# EAGLE design logicBlocks-Input (EAGLE 6.2)
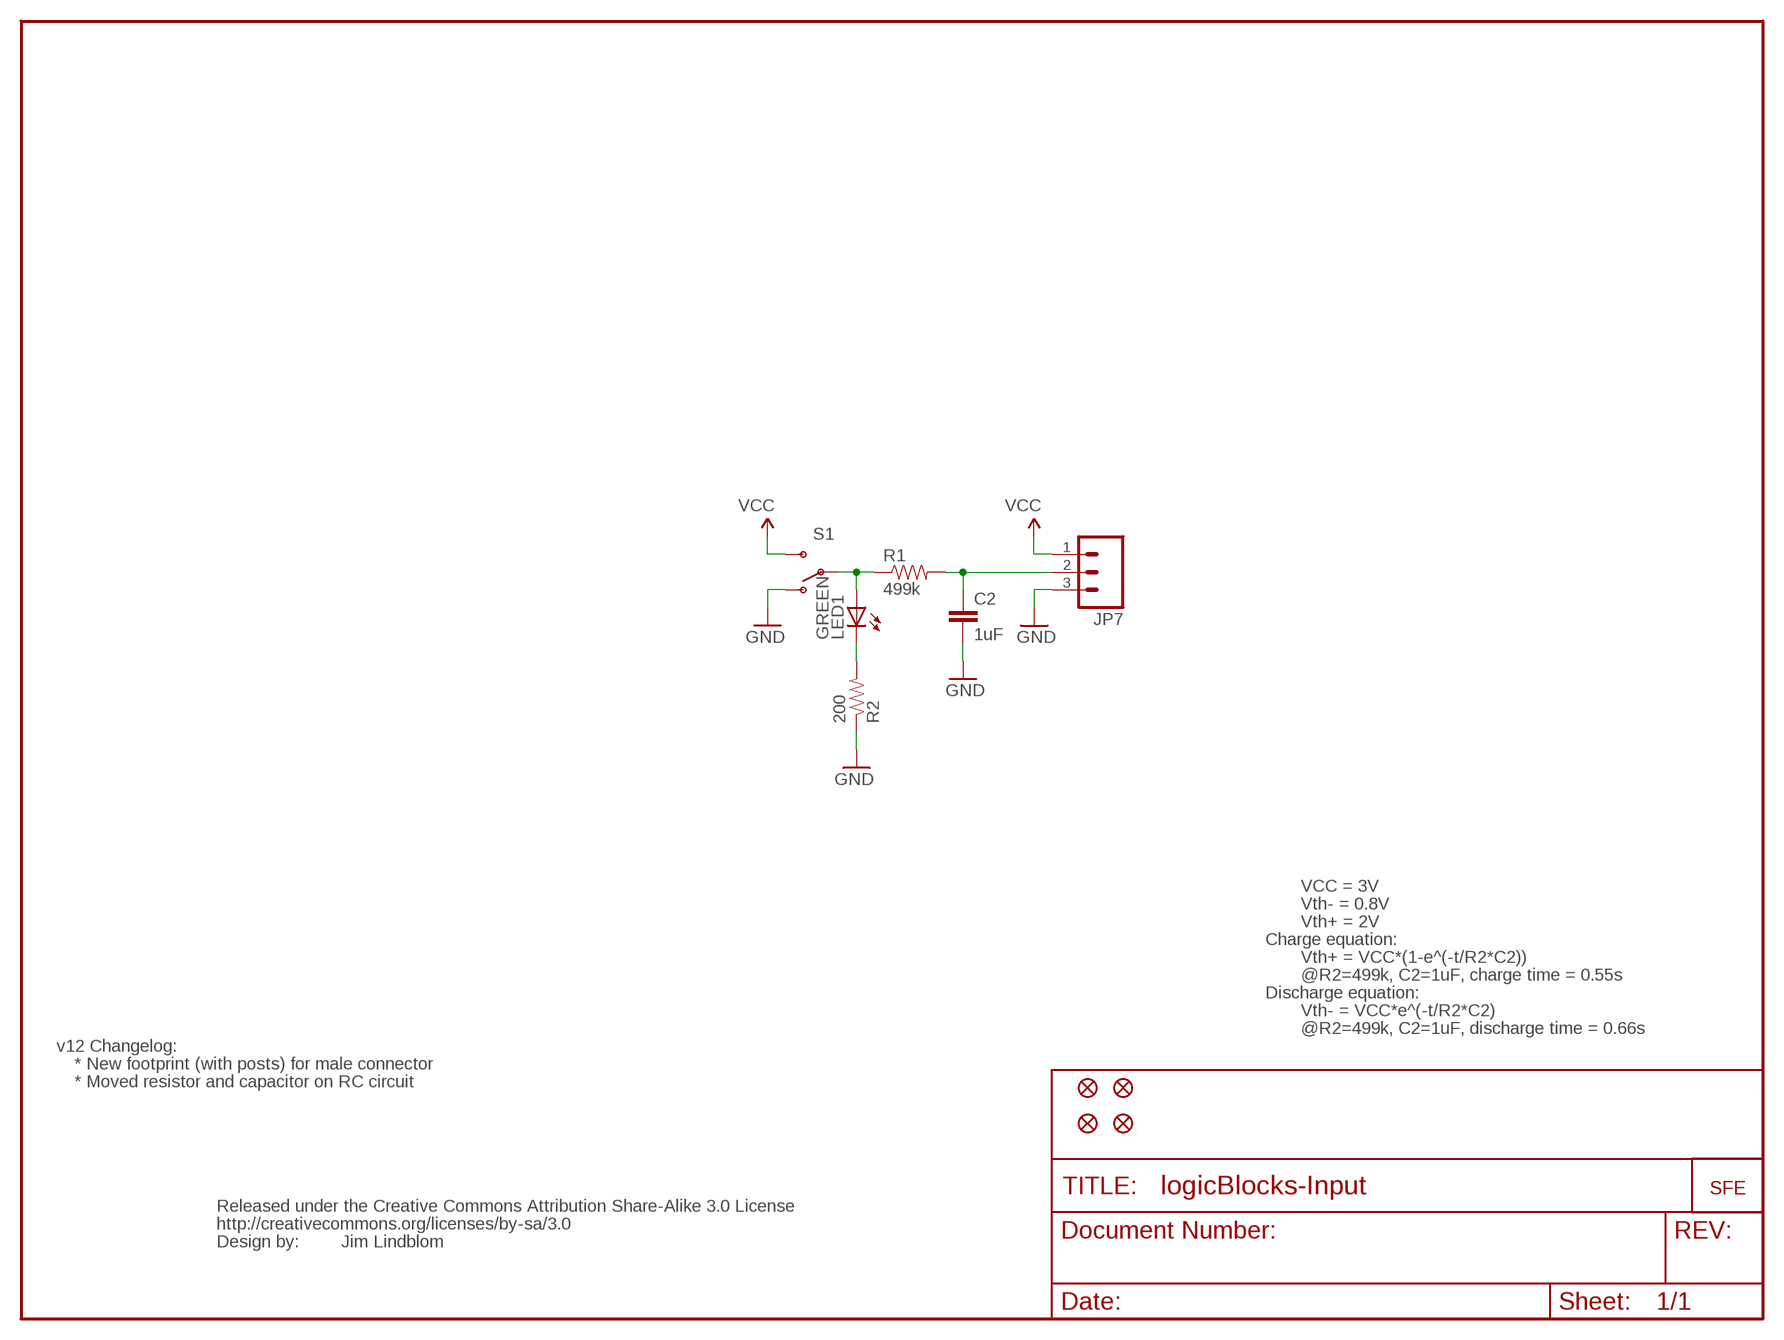
[diagram p0: schematic, sheet 1]

## Parts
C2  1uF  CAP0402-CAP  [0402-CAP]
JP2  LOGO-SFESK  [SFE-LOGO-FLAME]
JP3  FIDUCIALUFIDUCIAL  [MICRO-FIDUCIAL]
JP4  FIDUCIALUFIDUCIAL  [MICRO-FIDUCIAL]
JP5  FIDUCIALUFIDUCIAL  [MICRO-FIDUCIAL]
JP6  FIDUCIALUFIDUCIAL  [MICRO-FIDUCIAL]
JP7  M03SMD_RA_MALE_POST  [1X03_SMD_RA_MALE_POST]
LED1  GREEN  LED1206  [LED-1206]
R1  499k  RESISTOR0402-RES  [0402-RES]
R2  200  RESISTOR0402-RES  [0402-RES]
S1  SWITCH-SPSTSMD  [AYZ0202]
U$2  CREATIVE_COMMONS  [CREATIVE_COMMONS]

## Nets
GND: C2.2 JP7.3 R2.1 S1.1(O)
N$1: C2.1 JP7.2 R1.2
N$2: LED1.A R1.1 S1.2(P)
N$5: LED1.C R2.2
VCC: JP7.1 S1.3(S)

## Notes on the sheet
- VCC = 3V
- Vth- = 0.8V
- Vth+ = 2V
- Charge equation:
- Vth+ = VCC*(1-e^(-t/R2*C2))
- @R2=499k, C2=1uF, charge time = 0.55s
- Discharge equation:
- Vth- = VCC*e^(-t/R2*C2)
- @R2=499k, C2=1uF, discharge time = 0.66s
- v12 Changelog:
- * New footprint (with posts) for male connector
- * Moved resistor and capacitor on RC circuit
- Jim Lindblom

## Library data of the parts
C2 = SparkFun:CAP: Capacitor Standard 0603 ceramic capacitor, and 0.1" leaded capacitor.
JP2 = SparkFun:LOGO-SFE: Spark Fun Electronics PCB Logo This is the standard Spark Fun Electronics PCB logo.
JP3-JP6 = SparkFun:FIDUCIAL: Fiducial Alignment Points Various fiducial points for machine vision alignment.
JP7 = SparkFun-Connectors:M03: Header 3 Standard 3-pin 0.1" header. Use with straight break away headers (SKU : PRT-00116), right angle break away headers (PRT-00553), swiss pins (PRT-00743), machine pins (PRT-00117), and female headers (PRT-00115). Molex polarized connector foot print use with SKU : PRT-08232 with associated crimp pins and housings.
LED1 = SparkFun:LED: LEDs Standard schematic elements and footprints for 5mm, 3mm, 1206, and 0603 sized LEDs. 5mm - Spark Fun Electronics SKU : COM-00529 (and others)
R1 R2 = SparkFun:RESISTOR: Resistor Basic schematic elements and footprints for 0603, 1206, and PTH resistors.
S1 = SparkFun:SWITCH-SPST: SPST Switch Simple slide switch. Spark Fun Electronics SKU : COM-00102
U$2 = SparkFun:CREATIVE_COMMONS

## Board
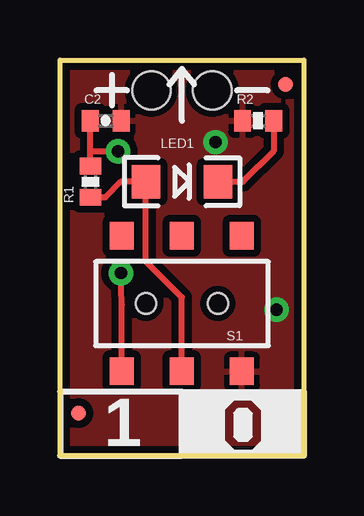
[diagram p1: board, top side]
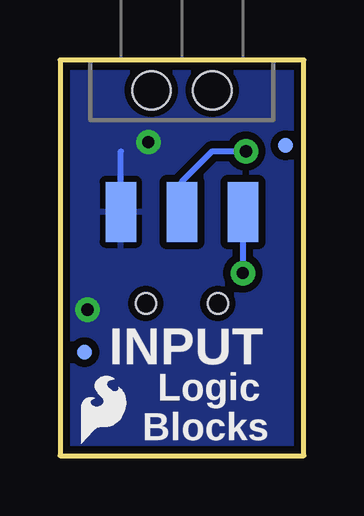
[diagram p2: board, bottom side, seen from below]

Size 10.16 x 16.51 mm. Coordinates in mm from the lower left corner, seen from the top.
Outline: 0,0 0,16.51 10.16,16.51 10.16,0 0,0
Copper layers (1*16): Top 0.035mm / dielectric 1.5mm / Bottom 0.035mm
Design rules: minimum track width 8mil, minimum drill 20mil, track to track 8mil, track to pad 8mil, pad to pad 8mil, via to via 8mil, smd to smd 8mil, copper to edge 8mil, drill to drill 8mil, minimum pad ring 12mil, minimum via ring 10mil, stop-mask expansion 4mil, vias tented up to drill 20mil, thermal gap 10mil

### Footprints (pad centres in the part's own frame; a part is rotated, then mirrored left to right if it is on the bottom)
0402-CAP = smd 0.7 x 0.9: 1 -0.65,0; 2 0.65,0
MICRO-FIDUCIAL = smd 0.635 x 0.635: 1 0,0
1X03_SMD_RA_MALE_POST = smd 1.27 x 2.5: 1 -2.54,5.07; 2 0,5.07; 3 2.54,5.07 | hole 1.6: -1.27,0; 1.27,0
LED-1206 = smd 1.2 x 1.4: A -1.5,0; C 1.5,0
0402-RES = smd 0.7 x 0.9: 1 -0.65,0; 2 0.65,0
AYZ0202 = smd 1 x 1.15: 1 -2.5,2.825; 2 0,2.825; 3 2.5,2.825; 4 -2.5,-2.825; 5 0,-2.825; 6 2.5,-2.825 | hole 0.85: 1.5,0; -1.5,0

### Placement (x,y rotation side)
C2  1.91,13.97 0 top
JP2  9.27,0.51 0 bottom
JP3  9.14,4.32 0 bottom
JP4  0.76,12.95 0 bottom
JP5  0.76,1.78 0 top
JP6  9.4,15.49 0 top
JP7  5.08,15.24 180 bottom
LED1  5.08,11.43 0 top
R1  1.27,11.43 90 top
R2  8.26,13.97 0 top
S1  5.08,6.35 180 top
U$2  10.16,-2.54 0 bottom

### Tracks (layer width: path | path; a pad name or v marks a point on that pad's centre or on a via)
GND  (via drill 0.51)
  Bottom 0.254: JP7.3 7.62,12.7
  other vias: 9.02,6.1 6.48,13.08
  pour Bottom (isolate 0.305): 10.16,16.51 10.16,0 0,0 0,16.51
  pour Top (isolate 0.305): 10.16,16.51 10.16,0 0,0 0,16.51
N$1  (via drill 0.51)
  Top 0.254: R1.2 1.27,12.7 | 1.27,12.7 1.27,13.96 C2.1 | 1.27,12.7 v2.41,12.7
  Bottom 0.254: JP7.2 5.08,11.43 3.81,12.7 v2.41,12.7
N$2
  Top 0.254: S1.2 5.08,6.6 3.58,8.1 LED1.A 2.54,11.43 1.89,10.78 R1.1
N$5
  Top 0.254: LED1.C 7.62,11.43 8.9,12.71 R2.2
VCC  (via drill 0.51)
  Top 0.254: S1.3 2.58,6.31 v2.54,7.62
  Bottom 0.254: JP7.1 v2.54,7.62

### Text on the board
tPlace: 1
bPlace: INPUT | Logic | Blocks